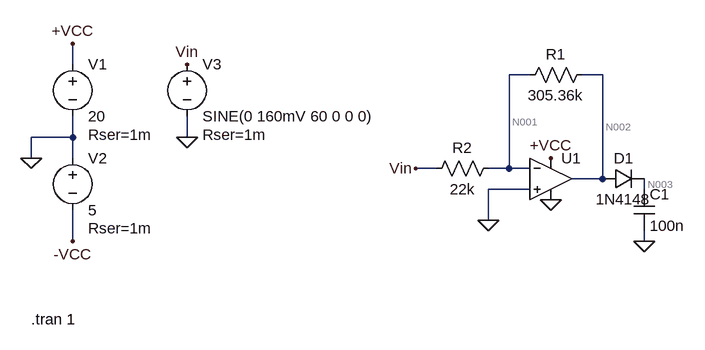
[diagram p0: schematic OpAmpInversor.asc]
OpAmpInversor.asc, the LTspice schematic file:
Version 4
SHEET 1 880 680
WIRE -512 -96 -512 -128
WIRE 192 -80 160 -80
WIRE 304 -80 272 -80
WIRE -512 16 -512 -16
WIRE -512 16 -576 16
WIRE -336 16 -336 -16
WIRE -576 48 -576 16
WIRE -512 48 -512 16
WIRE 48 64 16 64
WIRE 160 64 160 -80
WIRE 160 64 128 64
WIRE 192 64 160 64
WIRE 304 80 304 -80
WIRE 304 80 256 80
WIRE 192 96 128 96
WIRE 368 96 368 80
WIRE 128 144 128 96
WIRE -512 176 -512 128
WIRE 368 176 368 160
FLAG -512 -128 +VCC
FLAG -512 176 -VCC
FLAG -576 48 0
FLAG 224 112 0
FLAG 224 48 +VCC
FLAG 128 144 0
FLAG 16 64 Vin
FLAG -336 16 0
FLAG -336 -96 Vin
FLAG 368 176 0
SYMBOL Opamps\\UniversalOpamp2 224 80 R0
SYMATTR InstName U1
SYMBOL voltage -512 -112 R0
WINDOW 123 0 0 Left 2
WINDOW 39 24 124 Left 2
SYMATTR SpiceLine Rser=1m
SYMATTR InstName V1
SYMATTR Value 20
SYMBOL voltage -512 32 R0
WINDOW 123 0 0 Left 2
WINDOW 39 24 124 Left 2
SYMATTR SpiceLine Rser=1m
SYMATTR InstName V2
SYMATTR Value 5
SYMBOL res 176 -64 R270
WINDOW 0 32 56 VTop 2
WINDOW 3 0 56 VBottom 2
SYMATTR InstName R1
SYMATTR Value 305.36k
SYMBOL res 32 80 R270
WINDOW 0 32 56 VTop 2
WINDOW 3 0 56 VBottom 2
SYMATTR InstName R2
SYMATTR Value 22k
SYMBOL voltage -336 -112 R0
WINDOW 123 0 0 Left 2
WINDOW 39 24 124 Left 2
SYMATTR SpiceLine Rser=1m
SYMATTR InstName V3
SYMATTR Value SINE(0 160mV 60 0 0 0)
SYMBOL cap 352 96 R0
SYMATTR InstName C1
SYMATTR Value 100n
SYMATTR SpiceLine V=100V Irms=0 Rser=0.002 Lser=0
SYMBOL diode 304 96 R270
WINDOW 0 32 32 VTop 2
WINDOW 3 0 32 VBottom 2
SYMATTR InstName D1
SYMATTR Value 1N4148
TEXT -576 296 Left 2 !.tran 1

The netlist it stands for:
* OpAmpInversor.asc
XU1 0 N001 +VCC 0 N002 level.2 Avol=1Meg GBW=10Meg Slew=10Meg ilimit=25m rail=0 Vos=0 phimargin=45 en=0 enk=0 in=0 ink=0 Rin=500Meg  ; pins IN+ IN- V+ V- OUT
V1 +VCC 0 20 Rser=1m
V2 0 -VCC 5 Rser=1m
R1 N001 N002 305.36k
R2 Vin N001 22k
V3 Vin 0 SINE(0 160mV 60 0 0 0) Rser=1m
C1 N003 0 100n V=100V Irms=0 Rser=0.002 Lser=0
D1 N002 N003 1N4148
.model D D
.lib standard.dio
.tran 1
.lib UniversalOpamps2.sub
.backanno
.end

* Results of the author's LTspice run, read from the files saved beside the schematic
* Operating Point, zero values left out:
*   V(n002) = 26.18 mV
*   V(+vcc) = 20 V
*   V(n001) = 2.169 mV
*   V(-vcc) = -5 V
*   V(n003) = 26.18 mV
*   I(R2) = -98.61 nA
*   I(R1) = -78.62 nA
*   I(V3) = 98.61 nA
*   I(V1) = -72.49 µA
*   Ix(u1:1) = -20 nA
*   Ix(u1:2) = -20 nA
*   Ix(u1:3) = 72.49 µA
*   Ix(u1:4) = -72.27 µA
*   Ix(u1:5) = -78.62 nA
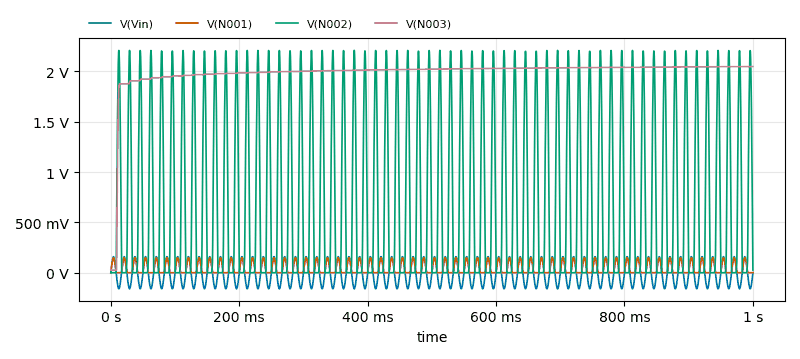
[diagram p1: Transient Analysis of OpAmpInversor.asc, plotted from the saved traces]
* Transient Analysis, 1 run:
*   V(Vin): min -159.6 mV, max 159.6 mV, average -365.5 µV, rms 111.8 mV, last 0 V
*   V(N001): min -5.646 µV, max 149.3 mV, average 46.97 mV, rms 73.94 mV, last 2.171 mV
*   V(N002): min 30.03 µV, max 2.209 V, average 697.8 mV, rms 1.095 V, last 26.19 mV
*   V(N003): min 26.08 mV, max 2.048 V, average 1.99 V, rms 2 V, last 2.048 V